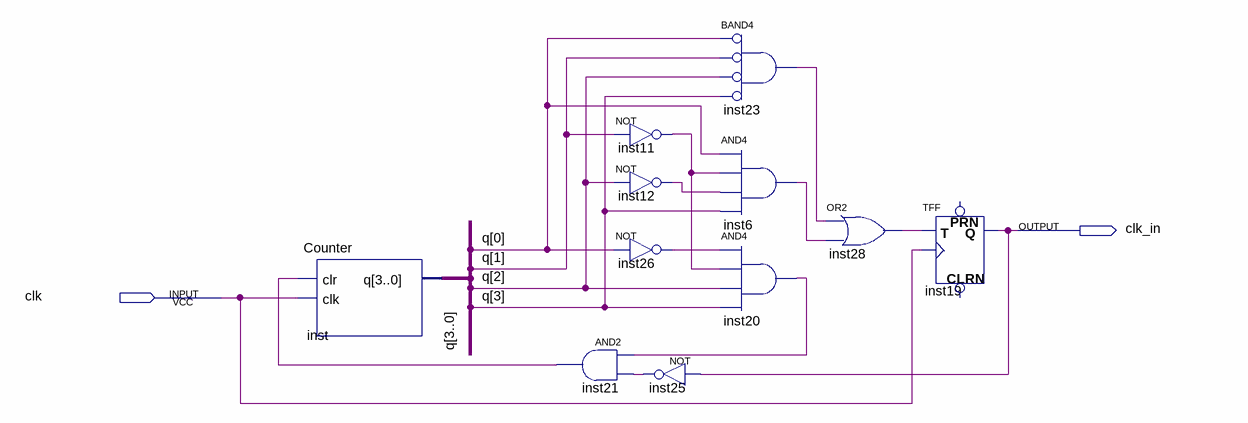
[diagram p0: schematic sheet]
// Quartus schematic Block1.bdf as structural Verilog: 11 symbols, 2 pins
module Block1 (
  input  clk,
  output clk_in
);

  wire inst6_out, inst11_out, inst12_out, inst20_out, inst21_out, inst23_out, inst25_out, inst26_out,
       inst28_out;
  wire [3:0] q;

  Counter inst (.clr(inst21_out), .clk(clk), .q(q));
  not inst11 (inst11_out, q[1]);
  not inst12 (inst12_out, q[2]);
  not inst26 (inst26_out, q[0]);
  and inst21 (inst21_out, inst20_out, inst25_out);
  not inst25 (inst25_out, clk_in);
  and inst23 (inst23_out, ~q[0], ~q[1], ~q[2], ~q[3]);  // BAND4
  and inst6 (inst6_out, q[0], inst11_out, inst12_out, q[3]);
  and inst20 (inst20_out, inst26_out, inst11_out, q[2], q[3]);
  or inst28 (inst28_out, inst23_out, inst6_out);
  TFF inst19 (.T(inst28_out), .CLK(clk), .Q(clk_in));  // open: PRN, CLRN
endmodule
